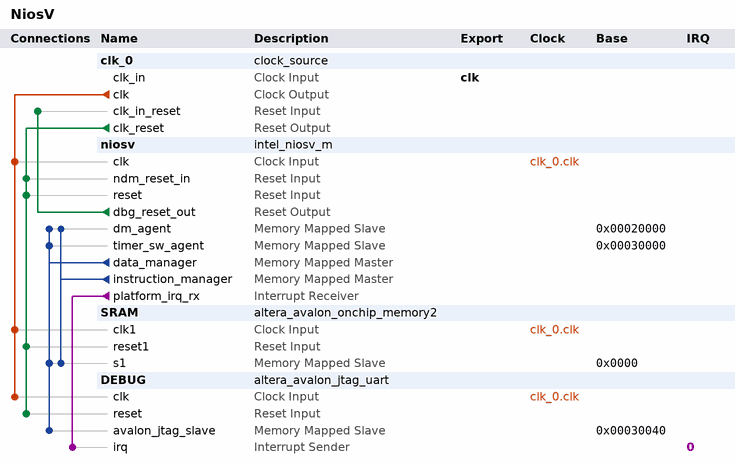
[diagram p0: system contents]
# Platform Designer (Qsys) system NiosV, Cyclone IV E EP4CE115F29C7
# Parameters at their usual value, and those the tool derives, are not listed.
package require -exact qsys 22.1
create_system NiosV
set_project_property DEVICE_FAMILY {Cyclone IV E}
set_project_property DEVICE EP4CE115F29C7

add_instance clk_0 clock_source 22.1
set_instance_parameter_value clk_0 clockFrequency 50000000

add_instance niosv intel_niosv_m 1.0.0
set_instance_parameter_value niosv enableDebugReset true
set_instance_parameter_value niosv resetSlave SRAM.s1

add_instance SRAM altera_avalon_onchip_memory2 22.1
set_instance_parameter_value SRAM dataWidth 32
set_instance_parameter_value SRAM dualPort false
set_instance_parameter_value SRAM initMemContent true
set_instance_parameter_value SRAM initializationFileName onchip_mem.hex
set_instance_parameter_value SRAM memorySize 131072

add_instance DEBUG altera_avalon_jtag_uart 22.1
set_instance_parameter_value DEBUG simInteractiveOptions NO_INTERACTIVE_WINDOWS

# connections
add_connection clk_0.clk DEBUG.clk clock
add_connection clk_0.clk niosv.clk clock
add_connection clk_0.clk SRAM.clk1 clock
add_connection clk_0.clk_reset DEBUG.reset reset
add_connection clk_0.clk_reset niosv.ndm_reset_in reset
add_connection clk_0.clk_reset niosv.reset reset
add_connection clk_0.clk_reset SRAM.reset1 reset
add_connection niosv.dbg_reset_out clk_0.clk_in_reset reset
add_connection niosv.data_manager DEBUG.avalon_jtag_slave avalon
set_connection_parameter_value niosv.data_manager/DEBUG.avalon_jtag_slave baseAddress 0x00030040
add_connection niosv.data_manager niosv.dm_agent avalon
set_connection_parameter_value niosv.data_manager/niosv.dm_agent baseAddress 0x00020000
add_connection niosv.data_manager niosv.timer_sw_agent avalon
set_connection_parameter_value niosv.data_manager/niosv.timer_sw_agent baseAddress 0x00030000
add_connection niosv.data_manager SRAM.s1 avalon
set_connection_parameter_value niosv.data_manager/SRAM.s1 baseAddress 0x0000
add_connection niosv.instruction_manager niosv.dm_agent avalon
set_connection_parameter_value niosv.instruction_manager/niosv.dm_agent baseAddress 0x00020000
add_connection niosv.instruction_manager SRAM.s1 avalon
set_connection_parameter_value niosv.instruction_manager/SRAM.s1 baseAddress 0x0000
add_connection niosv.platform_irq_rx DEBUG.irq interrupt
set_connection_parameter_value niosv.platform_irq_rx/DEBUG.irq irqNumber 0

# exported interfaces
add_interface clk clock sink
set_interface_property clk EXPORT_OF clk_0.clk_in

set_interconnect_requirement {$system} qsys_mm.clockCrossingAdapter HANDSHAKE
set_interconnect_requirement {$system} qsys_mm.enableEccProtection FALSE
set_interconnect_requirement {$system} qsys_mm.insertDefaultSlave FALSE
set_interconnect_requirement {$system} qsys_mm.maxAdditionalLatency 1

save_system NiosV.qsys
